# Altium schematic sheet 2015-02-06_15-55-141.schdoc
size 375 x 157 mm; SheetNumber: 1; SheetTotal: 1
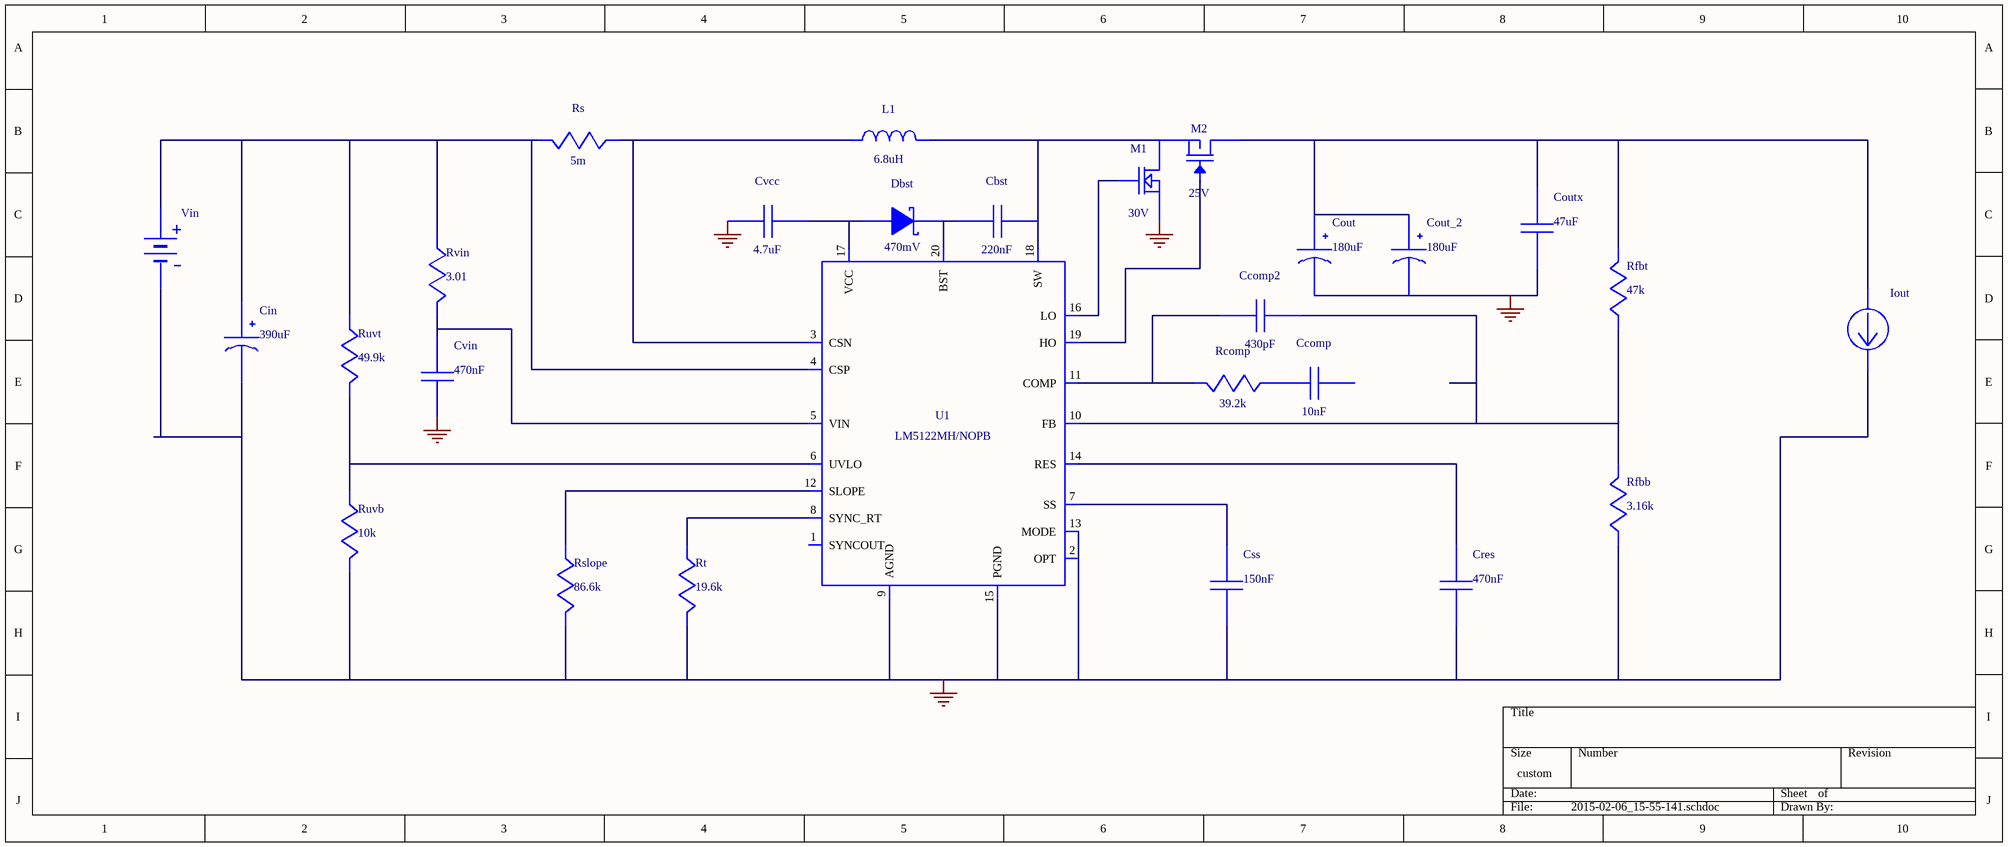
[diagram p0: 2015-02-06_15-55-141.schdoc]

## Parts
Cbst  value 220nF  (hidden comment: C0805C224K5RACTU)
Ccomp  value 10nF  (hidden comment: GRM216R71H103KA01D)
Ccomp2  value 430pF  (hidden comment: CL21C431JBANNNC)
Cin  value 390uF  (hidden comment: 20SVPF390M)
Cout  value 180uF  (hidden comment: 25SVPF180M)
Cout_2  value 180uF  (hidden comment: 25SVPF180M)
Coutx  value 47uF  (hidden comment: C3216JB1E476M)
Cres  value 470nF  (hidden comment: TMK212BJ474KD-T)
Css  value 150nF  (hidden comment: GRM155R61A154KE19D)
Cvcc  value 4.7uF  (hidden comment: GRM21BC81E475KA12L)
Cvin  value 470nF  (hidden comment: GRM188R71C474KA88D)
Dbst  value 470mV  (hidden comment: MBR130T1G)
Iout  WB_CURRENT_LOAD  (value not drawn)
L1  value 6.8uH  (hidden comment: XAL1010-682MEB)
M1  value 30V  (hidden comment: BSZ035N03MS G)
M2  value 25V  (hidden comment: CSD16340Q3)
Rcomp  value 39.2k  (hidden comment: CRCW040239K2FKED)
Rfbb  value 3.16k  (hidden comment: CRCW04023K16FKED)
Rfbt  value 47k  (hidden comment: RR1220P-473-D)
Rs  value 5m  (hidden comment: PRL1632-R005-F-T1)
Rslope  value 86.6k  (hidden comment: CRCW040286K6FKED)
Rt  value 19.6k  (hidden comment: CRCW040219K6FKED)
Ruvb  value 10k  (hidden comment: CRCW040210K0FKED)
Ruvt  value 49.9k  (hidden comment: CRCW040249K9FKED)
Rvin  value 3.01  (hidden comment: CRCW08053R01FKEA)
U1  LM5122MH/NOPB
Vin  WB_BATTERY  (value not drawn)

## Nets
0: Cin.2(-) Cout.2(-) Cout_2.2(-) Coutx.2 Cres.2 Css.2 Cvcc.1 Cvin.2 Iout.2(-) M1.1(Source) M1.2(Source) M1.3(Source) Rfbb.2 Rslope.1 Rt.1 Ruvb.1 U1.2(OPT) U1.9(AGND) U1.13(MODE) U1.15(PGND) U1.21(EP) Vin.2(-)
NetCbst_1: Cbst.1 Dbst.1(K) U1.20(BST)
NetCbst_2: Cbst.2 L1.2 M1.5(Drain) M1.6(Drain) M1.7(Drain) M1.8(Drain) M1.9(Drain) U1.18(SW)
NetCcomp2_1: Ccomp2.1 Rfbb.1 Rfbt.2 U1.10(FB)
NetCcomp2_2: Ccomp2.2 Rcomp.1 U1.11(COMP)
NetCcomp_2: Ccomp.2 Rcomp.2
NetCin_1: Cin.1(+) Rs.1 Ruvt.2 Rvin.2 U1.4(CSP) Vin.1(+)
NetCout_1: Cout.1(+) Cout_2.1(+) Coutx.1 Iout.1(+) Rfbt.1
NetCres_1: Cres.1 U1.14(RES)
NetCss_1: Css.1 U1.7(SS)
NetCvcc_2: Cvcc.2 Dbst.2(A) U1.17(VCC)
NetCvin_1: Cvin.1 Rvin.1 U1.5(VIN)
NetL1_1: L1.1 Rs.2 U1.3(CSN)
NetM1_4: M1.4(Gate) U1.16(LO)
NetM2_1: M2.1(Source) M2.2(Source) M2.3(Source)
NetM2_4: M2.4(Gate) U1.19(HO)
NetM2_5: M2.5(Drain) M2.6(Drain) M2.7(Drain) M2.8(Drain) M2.9(Drain)
NetRslope_2: Rslope.2 U1.12(SLOPE)
NetRt_2: Rt.2 U1.8(SYNC_RT)
NetRuvb_2: Ruvb.2 Ruvt.1 U1.6(UVLO)

Not connected (* = marked no-connect by the designer): Ccomp 1; U1 1(SYNCOUT)

## Library data of the parts
Cbst = C0805C224K5RACTU: Manufacturer Name: Kemet; PackageReference: C0805C224K5RACTU; Manufacturer Part Number: C0805C224K5RACTU
Ccomp = GRM216R71H103KA01D: GRM216R71H103KA0; Manufacturer Name: MuRata; PackageReference: GRM216R71H103KA01D; Manufacturer Part Number: GRM216R71H103KA01D
Ccomp2 = CL21C431JBANNNC: Manufacturer Name: Samsung Electro-Mechanics; PackageReference: CL21C431JBANNNC; Manufacturer Part Number: CL21C431JBANNNC
Cin = 20SVPF390M: Manufacturer Name: Panasonic; PackageReference: 20SVPF390M; Manufacturer Part Number: 20SVPF390M
Cout Cout_2 = 25SVPF180M: Manufacturer Name: Panasonic; PackageReference: 25SVPF180M; Manufacturer Part Number: 25SVPF180M
Coutx = C3216JB1E476M: Manufacturer Name: TDK; PackageReference: C3216JB1E476M; Manufacturer Part Number: C3216JB1E476M
Cres = TMK212BJ474KD-T: Manufacturer Name: Taiyo Yuden; PackageReference: TMK212BJ474KD-T; Manufacturer Part Number: TMK212BJ474KD-T
Css = GRM155R61A154KE19D: GRM155R61A154KE1; Manufacturer Name: MuRata; PackageReference: GRM155R61A154KE19D; Manufacturer Part Number: GRM155R61A154KE19D
Cvcc = GRM21BC81E475KA12L: GRM21BC81E475KA1; Manufacturer Name: MuRata; PackageReference: GRM21BC81E475KA12L; Manufacturer Part Number: GRM21BC81E475KA12L
Cvin = GRM188R71C474KA88D: GRM188R71C474KA8; Manufacturer Name: MuRata; PackageReference: GRM188R71C474KA88D; Manufacturer Part Number: GRM188R71C474KA88D
Dbst = MBR130T1G: Manufacturer Name: ON Semiconductor; PackageReference: MBR130T1G; Manufacturer Part Number: MBR130T1G
Iout = WB_CURRENT_LOAD: Value: UNLISTED; PackageReference: WB_CURRENT_LOAD; Manufacturer Part Number: WB_CURRENT_LOAD; Manufacturer Name: WB_CURRENT_LOAD
L1 = XAL1010-682MEB: Manufacturer Name: Coilcraft; PackageReference: XAL1010-682MEB; Manufacturer Part Number: XAL1010-682MEB
M1 = BSZ035N03MS G: Manufacturer Name: Infineon Technologies; PackageReference: BSZ035N03MS G; Manufacturer Part Number: BSZ035N03MS G
M2 = CSD16340Q3: Manufacturer Name: Texas Instruments; PackageReference: CSD16340Q3; Manufacturer Part Number: CSD16340Q3
Rcomp = CRCW040239K2FKED: Manufacturer Name: Vishay-Dale; PackageReference: CRCW040239K2FKED; Manufacturer Part Number: CRCW040239K2FKED
Rfbb = CRCW04023K16FKED: Manufacturer Name: Vishay-Dale; PackageReference: CRCW04023K16FKED; Manufacturer Part Number: CRCW04023K16FKED
Rfbt = RR1220P-473-D: Manufacturer Name: Susumu Co Ltd; PackageReference: RR1220P-473-D; Manufacturer Part Number: RR1220P-473-D
Rs = PRL1632-R005-F-T1: PRL1632-R005-F-T; Manufacturer Name: Susumu Co Ltd; PackageReference: PRL1632-R005-F-T1; Manufacturer Part Number: PRL1632-R005-F-T1
Rslope = CRCW040286K6FKED: Manufacturer Name: Vishay-Dale; PackageReference: CRCW040286K6FKED; Manufacturer Part Number: CRCW040286K6FKED
Rt = CRCW040219K6FKED: Manufacturer Name: Vishay-Dale; PackageReference: CRCW040219K6FKED; Manufacturer Part Number: CRCW040219K6FKED
Ruvb = CRCW040210K0FKED: Manufacturer Name: Vishay-Dale; PackageReference: CRCW040210K0FKED; Manufacturer Part Number: CRCW040210K0FKED
Ruvt = CRCW040249K9FKED: Manufacturer Name: Vishay-Dale; PackageReference: CRCW040249K9FKED; Manufacturer Part Number: CRCW040249K9FKED
Rvin = CRCW08053R01FKEA: Manufacturer Name: Vishay-Dale; PackageReference: CRCW08053R01FKEA; Manufacturer Part Number: CRCW08053R01FKEA
U1 = LM5122MH/NOPB: Manufacturer Name: Texas Instruments; Value: UNLISTED; PackageReference: LM5122MH/NOPB; Manufacturer Part Number: LM5122MH/NOPB
Vin = WB_BATTERY: Value: UNLISTED; PackageReference: WB_BATTERY; Manufacturer Part Number: WB_BATTERY; Manufacturer Name: WB_BATTERY